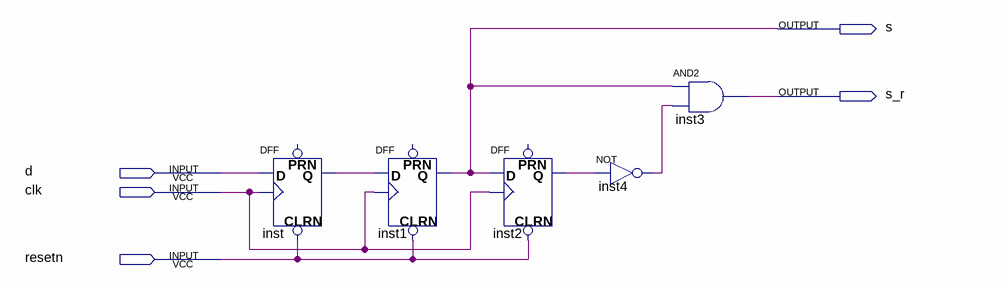
[diagram p0: schematic sheet]
// Quartus schematic input_sync_ff.bdf as structural Verilog: 5 symbols, 5 pins
module input_sync_ff (
  input  d,
  input  clk,
  input  resetn,
  output s,
  output s_r
);

  wire inst2_q, inst4_out, inst_q;

  DFF inst (.CLRN(resetn), .CLK(clk), .D(d), .Q(inst_q));  // open: PRN
  DFF inst1 (.CLRN(resetn), .CLK(clk), .D(inst_q), .Q(s));  // open: PRN
  DFF inst2 (.CLRN(resetn), .CLK(clk), .D(s), .Q(inst2_q));  // open: PRN
  not inst4 (inst4_out, inst2_q);
  and inst3 (s_r, s, inst4_out);
endmodule
